# EAGLE design vacmonitor (EAGLE 9.6.2)
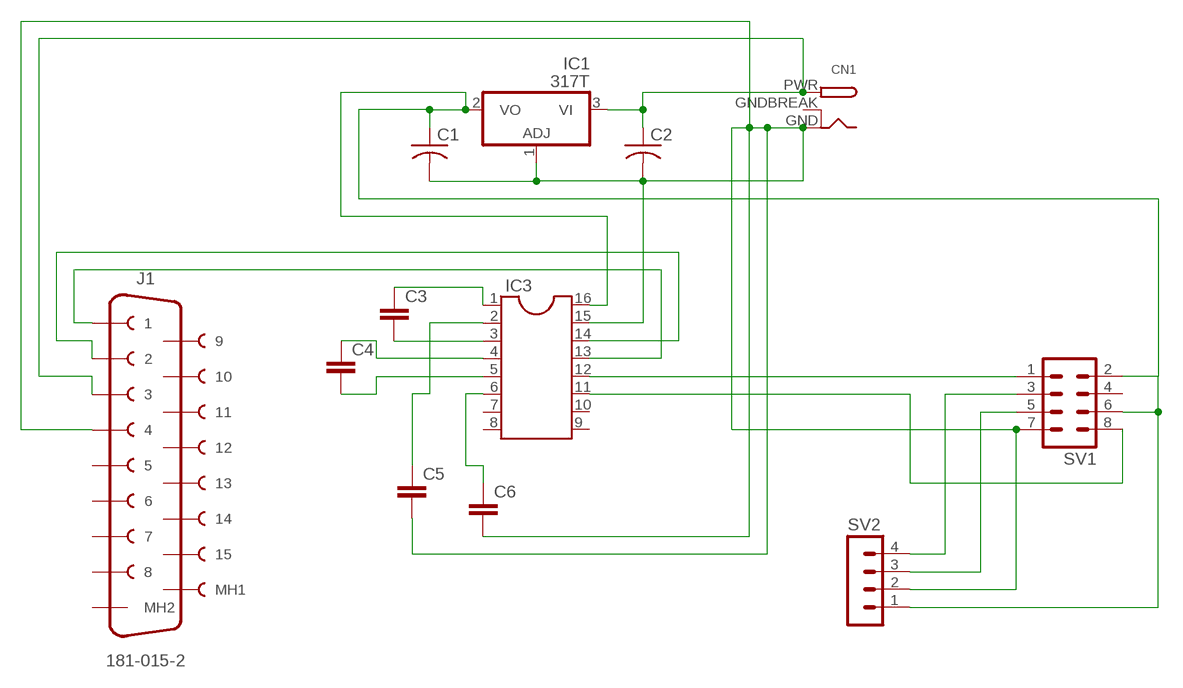
[diagram p0: schematic, sheet 1]

## Parts
C1  C-US025-024X044  [C025-024X044]
C2  C-US025-024X044  [C025-024X044]
C3  C5/3  [C5B3]
C4  C5/3  [C5B3]
C5  C5/3  [C5B3]
C6  C5/3  [C5B3]
CN1  DCBARRELPTH  [DCJACK_2MM_PTH]
IC1  317T  [TO220H]
IC3  DIL16  [DIL16]
J1  181-015-2  [181-015-213R561]
SV1  MA04-2  [MA04-2]
SV2  MA04-1  [MA04-1]

## Nets
N$1: C2.1 CN1.PWR IC1.3(VI) J1.3
N$2: IC3.11 SV1.8
N$4: IC3.12 SV1.1
N$5: IC3.13 J1.1
N$6: IC3.14 J1.2
N$7: C1.1 IC1.2(VO) IC3.16 SV1.2 SV1.6 SV2.1
N$8: C3.1 IC3.1
N$9: C3.2 IC3.3
N$10: C4.1 IC3.4
N$11: C4.2 IC3.5
N$12: C5.1 IC3.2
N$14: C6.1 IC3.6
N$15: SV1.5 SV2.3
N$16: SV1.3 SV2.4
N$17: C1.2 C2.2 C5.2 C6.2 CN1.GND IC1.1(ADJ) IC3.15 J1.4 SV1.7 SV2.2
Unconnected: IC3.7 IC3.8 IC3.9 IC3.10 J1.5 J1.6 J1.7 J1.8 J1.9 J1.10 J1.11 J1.12 J1.13 J1.14 J1.15 J1.MH1 J1.MH2 SV1.4

## Power pins joined to a net without a drawn wire
GNDBREAK: CN1.GNDBREAK

## Library data of the parts
C1 C2 = adafruit:C-US: CAPACITOR, American symbol
C3-C6 = capacitor-wima:C: CAPACITOR naming: grid - package width
CN1 = adafruit:DCBARREL: 2.0mm DC Barrel Jack DCJACK_2MM_PTH - Through Hole Jack (4UConnector: 05537)
IC1 = linear:*317: Positive VOLTAGE REGULATOR
IC3 = ic-package:DIL16: Dual In Line / Socket
J1 = Connector_D-Sub:181-015-2: D-SUB, 15POS, RCPT, R/A SLDR Datasheet <https://content.norcomp.net/rohspdfs/Connectors/18Y/181/181-YYY-213RYY1.pdf>; CATEGORY: Connector; GENDER: Female; MANUFACTURER: NorComp; MPN: 181-015-213R561; OPERATING_TEMPERATURE: -50 C to +100 C; PART_STATUS: ACTIVE; ROHS_COMPLIANT: COMPLIANT; SERIES: 181; SUB_CATEGORY: D-SUB; TYPE: R/A
SV1 = con-lstb:MA04-2: PIN HEADER; OC_FARNELL: unknown; OC_NEWARK: unknown
SV2 = con-lstb:MA04-1: PIN HEADER; OC_FARNELL: unknown; OC_NEWARK: unknown

## Board
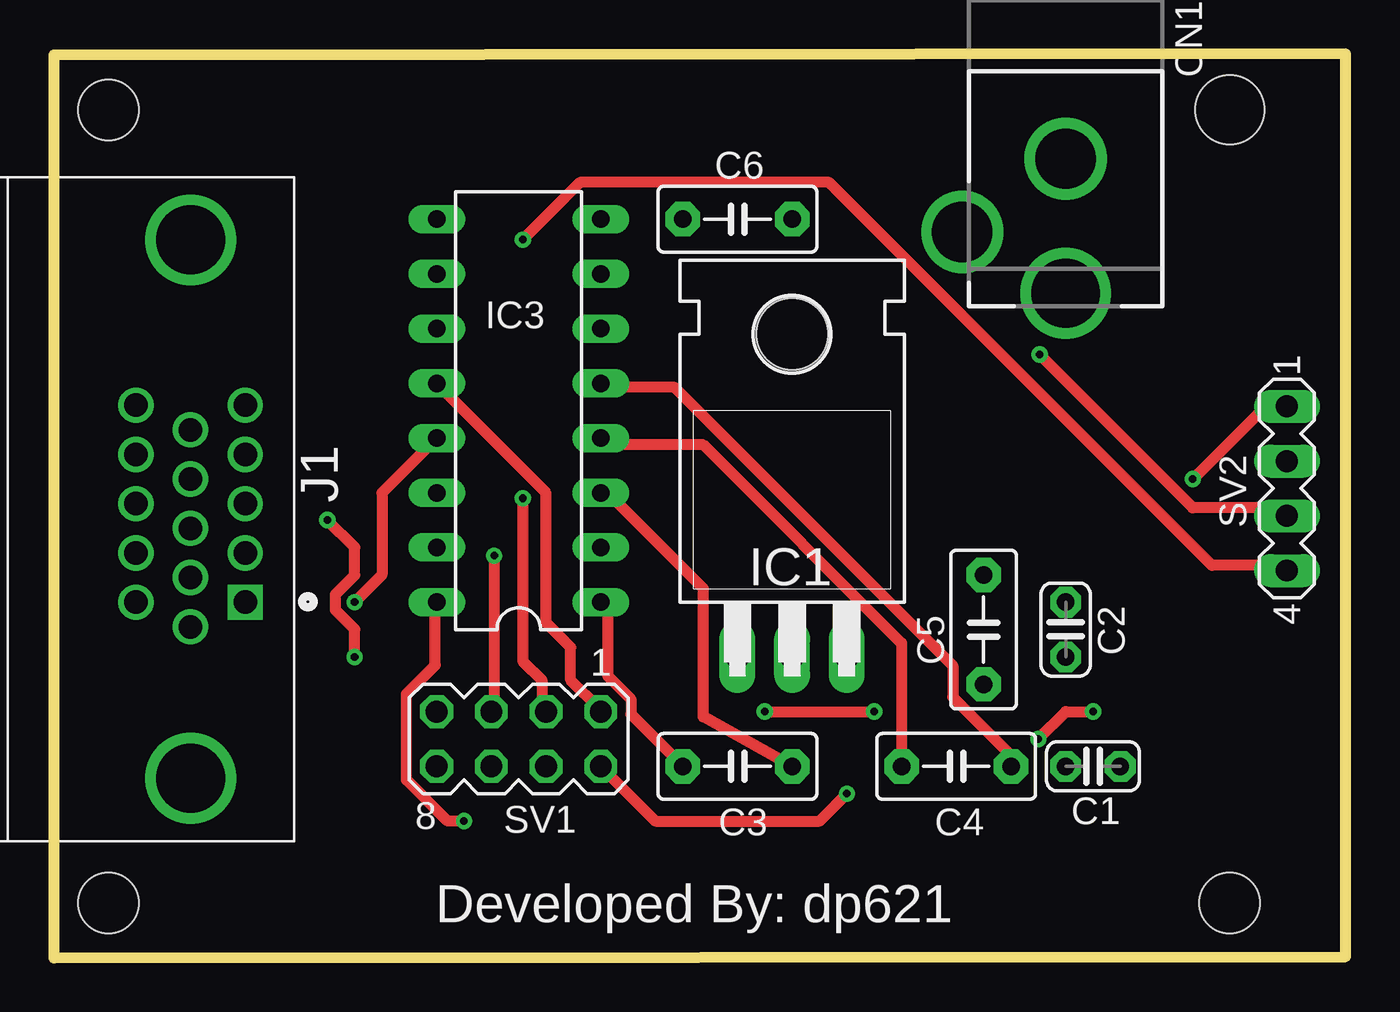
[diagram p1: board, top side]
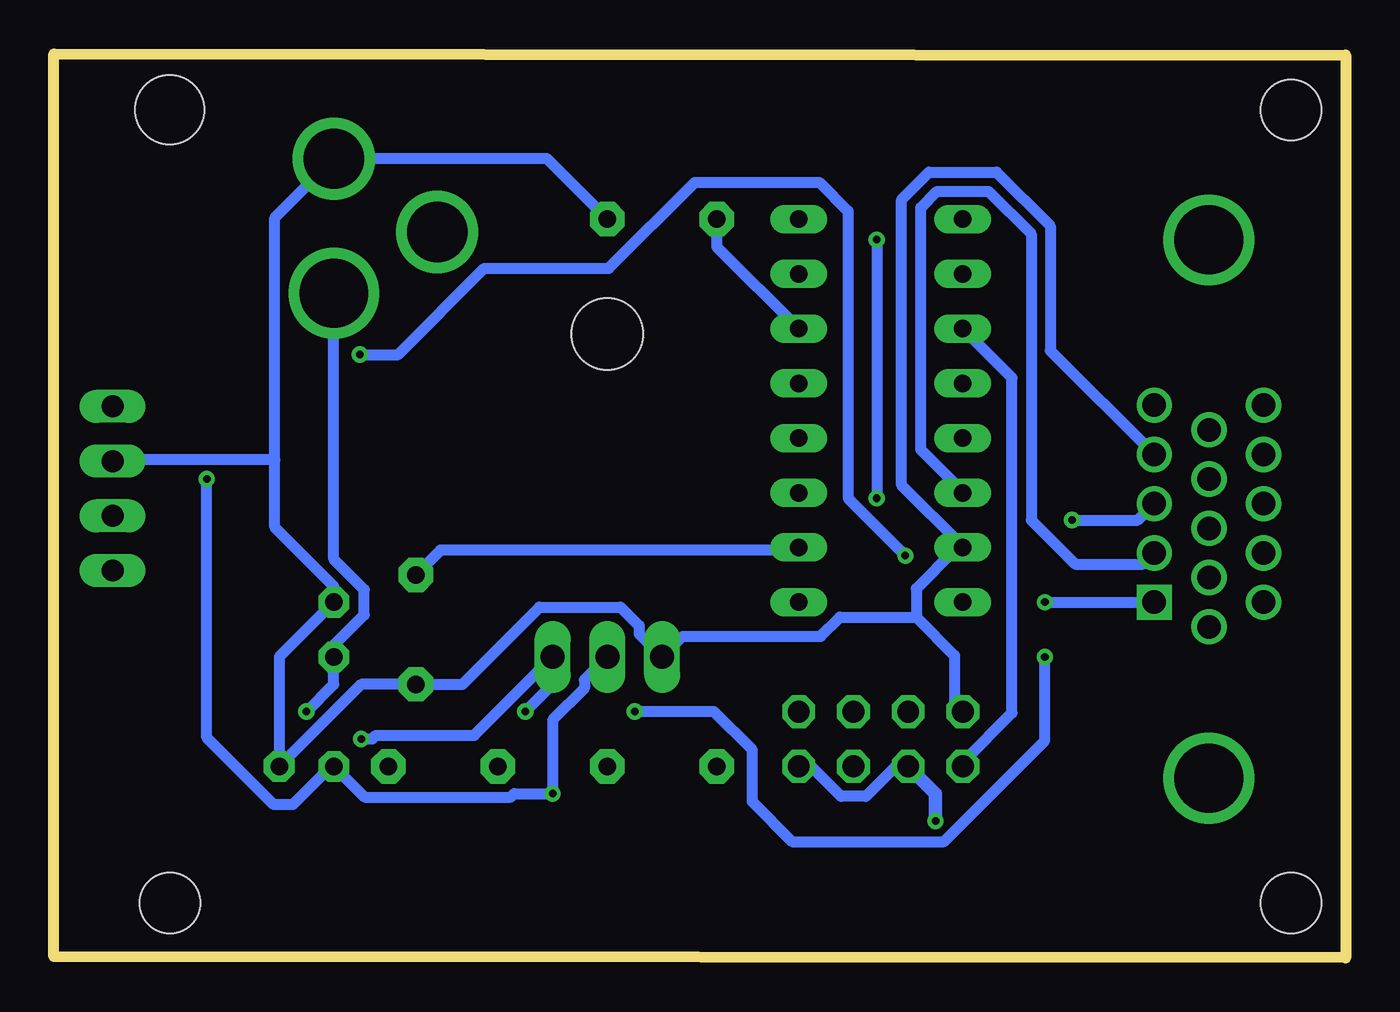
[diagram p2: board, bottom side, seen from below]

Size 60 x 41.97 mm. Coordinates in mm from the lower left corner, seen from the top.
Outline: 0,41.91 0,0 60,0.06 60,41.97 0,41.91
Copper layers (1*16): Top 0.035mm / dielectric 1.5mm / Bottom 0.035mm
Design rules "default *": minimum track width 20mil, minimum drill 0.35mm, track to track 15mil, track to pad 15mil, pad to pad 15mil, via to via 6mil, smd to smd 6mil, copper to edge 30mil, drill to drill 6mil, minimum pad ring 10mil, minimum via ring 8mil, stop-mask expansion 4mil, vias tented up to drill 0mil, thermal gap 10mil
Holes 2.8 mm at 2.54,39.37 2.54,2.54 54.61,2.54
Holes 3.2 mm at 54.61,39.37

### Footprints (pad centres in the part's own frame; a part is rotated, then mirrored left to right if it is on the bottom)
C025-024X044 = drill 0.813 pad 1.422 octagon: 1 -1.27,0; 2 1.27,0
C5B3 = drill 0.813 pad 1.6 octagon: 1 -2.54,0; 2 2.54,0
DCJACK_2MM_PTH = drill 2.8: GND 0,7.35; GNDBREAK 4.8,10.75 | drill 3.2: PWR 0,13.6
TO220H = drill 1.118 long: 1 -2.54,-10.16; 2 0,-10.16; 3 2.54,-10.16 | hole 3.302: 0,4.826
DIL16 = drill 0.813 long: 1 -8.89,-3.81; 2 -6.35,-3.81; 3 -3.81,-3.81; 4 -1.27,-3.81; 5 1.27,-3.81; 6 3.81,-3.81; 7 6.35,-3.81; 8 8.89,-3.81; 9 8.89,3.81; 10 6.35,3.81; 11 3.81,3.81; 12 1.27,3.81; 13 -1.27,3.81; 14 -3.81,3.81; 15 -6.35,3.81; 16 -8.89,3.81
181-015-213R561 = drill 1.092 square: 1 0,0 | drill 1.092: 2 -2.286,0; 3 -4.572,0; 4 -6.858,0; 5 -9.144,0; 6 1.143,-2.54; 7 -1.143,-2.54; 8 -3.429,-2.54; 9 -5.715,-2.54; 10 -8.001,-2.54; 11 0,-5.08; 12 -2.286,-5.08; 13 -4.572,-5.08; 14 -6.858,-5.08; 15 -9.144,-5.08 | drill 3.2: MH1 -16.817,-2.54; MH2 8.177,-2.54
MA04-2 = drill 1.016 octagon: 1 -3.81,-1.27; 2 -3.81,1.27; 3 -1.27,-1.27; 4 -1.27,1.27; 5 1.27,-1.27; 6 1.27,1.27; 7 3.81,-1.27; 8 3.81,1.27
MA04-1 = drill 1.016 long: 1 -3.81,0; 2 -1.27,0; 3 1.27,0; 4 3.81,0

### Placement (x,y rotation side)
C1  48.26,8.89 0 top
C2  46.99,15.24 90 top
C3  31.75,8.89 0 top
C4  41.91,8.89 0 top
C5  43.18,15.24 270 top
C6  31.75,34.29 0 top
CN1  46.99,44.45 180 top
IC1  34.29,24.13 0 top
IC3  21.59,25.4 90 top
J1  8.89,16.51 270 top
SV1  21.59,10.16 180 top
SV2  57.27,21.79 270 top

### Tracks (layer width: path | path; a pad name or v marks a point on that pad's centre or on a via)
N$1  (via drill 0.35)
  Top 0.508: v13.97,13.97 13.97,15.25 13.08,16.14 13.08,16.88 13.97,17.77 13.97,19.05 v12.7,20.32 | v45.72,10.16 46.99,11.43 v48.26,11.43 | v33.02,11.43 v38.1,11.43
  Bottom 0.508: v13.97,13.97 13.97,10.08 18.66,5.4 25.7,5.4 27.56,7.25 27.56,9.65 29.34,11.43 v33.02,11.43 | v12.7,20.32 9.65,20.32 J1.3 | v48.26,11.43 46.99,12.7 C2.1 46.99,14.52 45.58,15.93 45.58,17.09 46.99,18.5 CN1.PWR | v45.72,10.16 45.21,10.16 45.04,10.32 40.48,10.32 IC1.3 36.83,12.7 v38.1,11.43
N$2
  Bottom 0.508: IC3.11 15.49,26.92 15.49,11.37 17.72,9.14 SV1.8
N$4
  Top 0.508: IC3.12 22.86,21.59 22.86,15.56 24,14.41 24,12.89 25.34,11.56 SV1.1
N$5  (via drill 0.35)
  Top 0.508: IC3.13 15.24,21.59 15.24,17.78 v13.97,16.51
  Bottom 0.508: v13.97,16.51 J1.1
N$6
  Bottom 0.508: IC3.14 17.78,21.64 19.74,23.59 19.74,34.83 18.98,35.59 16.58,35.59 14.61,33.61 14.61,20.32 12.56,18.28 9.41,18.28 J1.2
N$7  (via drill 0.35)
  Top 0.508: v19.05,6.35 18.29,6.35 16.38,8.26 16.38,12.26 17.72,13.59 17.72,16.26 17.78,16.45 IC3.16 | v36.83,7.62 35.56,6.35 27.94,6.35 SV1.2 | v52.9,22.23 56.01,25.34 56.9,25.34 SV2.1
  Bottom 0.508: SV1.6 20.88,8.89 22.28,7.49 23.44,7.49 24.84,8.89 24.93,8.89 | IC1.2 35.36,12.9 35.36,12.52 36.83,11.05 v36.83,7.62 38.61,7.62 38.78,7.46 45.55,7.46 C1.1 47.12,8.89 48.9,7.11 49.78,7.11 52.9,10.22 v52.9,22.23
  Bottom 0.635: 20.8,8.89 SV1.6 19.05,7.62 v19.05,6.35 | 24.93,8.89 SV1.2
N$8
  Top 0.508: IC3.1 25.72,16.26 25.72,13.09 26.8,12.01 26.8,11.3 C3.1
N$9
  Top 0.508: C3.2 30.16,11.18 30.16,17.14 25.72,21.59 IC3.3
N$10
  Top 0.508: IC3.4 25.72,23.81 30.16,23.81 39.37,14.61 C4.1
N$11
  Top 0.508: IC3.5 25.72,26.48 28.83,26.48 41.74,13.56 41.74,12.11 44.45,9.4 C4.2
N$12
  Bottom 0.508: IC3.2 25.72,18.92 42.04,18.92 C5.1
N$14
  Bottom 0.508: C6.1 29.21,33.02 IC3.6
N$15  (via drill 0.35)
  Top 0.508: v20.45,18.67 20.45,11.56 SV1.5 | v45.78,28 52.9,20.89 56.9,20.89 SV2.3
  Bottom 0.508: v20.45,18.67 23.11,21.34 23.11,34.67 24.45,36.01 30.23,36.01 34.23,32 40.01,32 44.01,28 v45.78,28
N$16  (via drill 0.35)
  Top 0.508: v21.78,21.34 21.78,13.78 22.67,12.89 22.67,11.56 SV1.3 | v21.78,33.34 24.45,36.01 36.01,36.01 53.78,18.22 56.9,18.22 SV2.4
  Bottom 0.508: v21.78,33.34 v21.78,21.34
N$17
  Bottom 0.508: 19.94,15.81 18.16,14.03 18.16,11.81 SV1.7 | 19.94,15.81 19.94,17.14 18.16,18.92 IC3.15 17.78,19.1 20.62,21.94 20.62,35.2 19.34,36.47 16.21,36.47 13.72,33.98 13.72,28.19 J1.4 | 19.94,15.81 23.5,15.81 24.38,14.92 30.8,14.92 IC1.1 32.82,15.04 32.82,15.42 33.68,16.28 37.44,16.28 41.02,12.7 C5.2 45.72,12.7 C1.2 49.53,13.97 C2.2 46.99,17.25 49.73,19.99 49.73,23.11 | C6.2 37.1,37.1 CN1.GND 49.73,34.36 49.73,23.11 | 49.73,23.11 56.9,23.11 SV2.2

### Text on the board
tNames: Developed By: dp621